# Altium schematic sheet sch.schdoc
size 297 x 209 mm; Symbol: Drawing-Symbol_A4; @Project Name: usbhub; @Page Count: 1; @Update Date: 2026-06-14; @Create Date: 2026-06-14; @Schematic Name: Schematic1; @Page No: 1; @Page Name: P1; Company: EasyEDA.com; Version: V1.0; Page Size: A4; Device: Drawing-Symbol_A4; @Create Time: 20:09:06; @Update Time: 20:09:06; Border: 1; Width: 1170; Height: 825; Region Start: 1; X Region Count: 6; Y Region Count: 4; Blade Width: 10; Title Block Position: 3; @Board Name: Board1
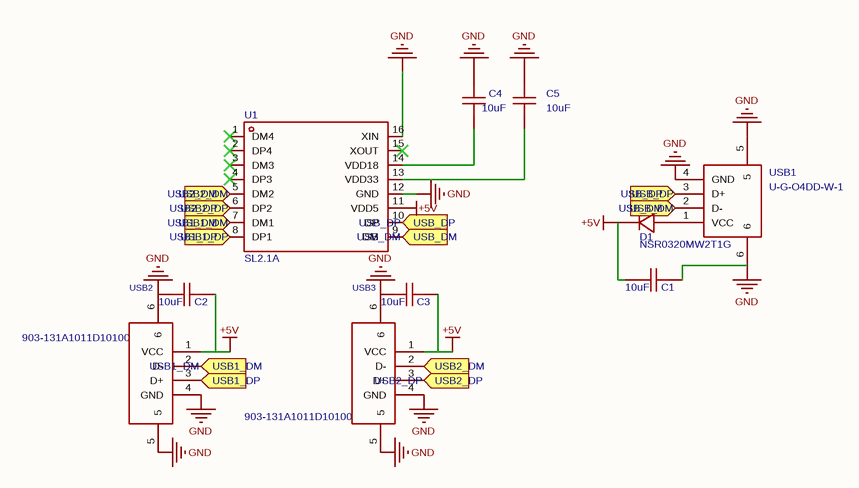
[diagram p0: sch.schdoc]

## Parts
C1  10uF  [C0603]
C2  10uF  [C0603]
C3  10uF  [C0603]
C4  10uF  [C0603]
C5  10uF  [C0603]
D1  NSR0320MW2T1G  [SOD-323_L1.8-W1.3-LS2.5-RD]
U1  SL2.1A  [SOP-16_L10.0-W3.9-P1.27-LS6.0-BL]
USB1  U-G-O4DD-W-1  [USB-A-TH_U-G-04WD-W-01]
USB2  903-131A1011D10100  [USB-A-TH_C46407]
USB3  903-131A1011D10100  [USB-A-TH_C46407]

## Ports
USB1_DM (in), USB1_DP (in), USB2_DM (in), USB2_DP (in), USB_DM (in), USB_DP (in)

## Nets
+5V: C1.1 C2.2 C3.2 D1.1(C) U1.11(VDD5) USB2.1(VCC) USB3.1(VCC)
GND: C1.2 C2.1 C3.1 C4.2 C5.2 U1.12(GND) U1.16(XIN) USB1.4(GND) USB1.5 USB1.6 USB2.4(GND) USB2.5 USB2.6 USB3.4(GND) USB3.5 USB3.6
USB1_DM: U1.7(DM1) USB2.2(D-) ; port USB1_DM
USB1_DP: U1.8(DP1) USB2.3(D+) ; port USB1_DP
USB2_DM: U1.5(DM2) USB3.2(D-) ; port USB2_DM
USB2_DP: U1.6(DP2) USB3.3(D+) ; port USB2_DP
USB_DM: U1.9(DM) USB1.2(D-) ; port USB_DM
USB_DP: U1.10(DP) USB1.3(D+) ; port USB_DP
NetC4_1: C4.1 U1.14(VDD18)
NetC5_1: C5.1 U1.13(VDD33)
NetD1_2: D1.2(A) USB1.1(VCC)

Not connected (* = marked no-connect by the designer): U1 1(DM4)* 2(DP4)* 3(DM3)* 4(DP3)* 15(XOUT)*

## Notes on the sheet
- Create at
- 2026-06-14
- Schematic
- Board
- Schematic1
- Board1
- Update at
- Page
- P1
- Drawn
- Reviewed
- usbhub
- Version
- V1.0
- Size
- A4
- Page  1  Total  1
- EasyEDA.com

## Library data of the parts
C1-C5 = CL10A106KP8NNNC: Capacitance:10uF Tolerance:±10% Tolerance:±10% Voltage Rating:10V Temperature Coefficient:X5R; Manufacturer: SAMSUNG(三星); AddInBom: yes; ModelId: 624118aa3cc7497086c383c2d72e08520819f05c4eef4c71ace90d822a990e87; ModelName: C0603_L1.6-W0.8-H0.8; ModelTransform: 62.992,31.496,0,0,0,0,0,0,0; Tolerance: ±10%; Voltage Rating: 10V; Temperature Coefficient: X5R; Symbol: CL10A106KP8NNNC; Device: CL10A106KP8NNNC; LCSC Part Name: 10uF ±10% 10V; SupplierPart: C19702; ManufacturerPart: CL10A106KP8NNNC; Supplier Footprint: 0603; JLCPCB Part Class: Basic Part; Datasheet: https://item.szlcsc.com/datasheet/CL10A106KP8NNNC/20411.html; Supplier: LCSC; ConvertToPcb: yes; FootprintName: C0603; Value: 10uF
D1 = NSR0320MW2T1G: Voltage - Forward(Vf@If):500mV@900mA Voltage - DC Reverse(Vr):20V Current - Rectified:1A Reverse Leakage Current (Ir):50uA@15V Operating Junction Temperature Range:-55℃~+125℃ Operating Junction Temperature Range:-55℃~+125℃ Non-Repetitive Peak Forward Surg; Manufacturer: onsemi(安森美); AddInBom: yes; ModelId: 533ebfb2f206414f9035ed0ccba1097d0819f05c4eef4c71ace90d822a990e87; ModelTransform: 104.3305,51.181,0,0,0,0,0,-0.004,0; Voltage - DC Reverse(Vr): 20V; Current - Rectified: 1A; Non-Repetitive Peak Forward Surge Current: 5A; Symbol: NSR0320MW2T1G; Device: NSR0320MW2T1G; LCSC Part Name: 电压:20V 电流:1A; SupplierPart: C48192; ManufacturerPart: NSR0320MW2T1G; Supplier Footprint: SOD-323; JLCPCB Part Class: Extended Part; Datasheet: https://item.szlcsc.com/datasheet/NSR0320MW2T1G/49199.html; Supplier: LCSC; ConvertToPcb: yes; FootprintName: SOD-323_L1.8-W1.3-LS2.5-RD; ModelName: SOD-323_L1.8-W1.3-LS2.5-RD; Voltage - Forward(Vf@If): 500mV@900mA; Reverse Leakage Current (Ir): 50uA@15V; Operating Junction Temperature Range: -55℃~+125℃
U1 = SL2.1A: type:Hub USB Protocol:USB 2.0 Voltage - Supply:4V~5.25V Voltage - Supply:4V~5.25V Operating Temperature:0℃~+70℃ Operating Temperature:0℃~+70℃ Current - Supply:120mA Supply Current (Iq):2.5mA Number of Channels:4; Manufacturer: CoreChips(和芯润德); AddInBom: yes; ModelId: 6bb57bd352844810b0c0d78800500b790819f05c4eef4c71ace90d822a990e87; ModelName: SOP-16_L9.9-W3.9-H1.5-LS6.0-P1.27; ModelTransform: 240.39054,393.7,0,90,0,0,0,0,0; USB Protocol: USB 2.0; Current - Supply: 120mA; Supply Current (Iq): 2.5mA; Number of Channels: 4; Symbol: SL2.1A; Device: SL2.1A; LCSC Part Name: USB2.0高速4端口HUB控制器; SupplierPart: C192893; ManufacturerPart: SL2.1A; Supplier Footprint: SOP-16; JLCPCB Part Class: Extended Part; Datasheet: https://item.szlcsc.com/datasheet/SL2.1A/225853.html; Supplier: LCSC; ConvertToPcb: yes; FootprintName: SOP-16_L10.0-W3.9-P1.27-LS6.0-BL; type: Hub; Voltage - Supply: 4V~5.25V; Operating Temperature: 0℃~+70℃
USB1 = U-G-O4DD-W-1: Connector Type:Type-A Protocol Standard:USB 2.0 Gender:Male Mounting Type:Laminated board Number of Contacts:4P Number of Ports:1 Current Rating-Power:1A Voltage Rating:30V Length:18.75mm Detection color:Black; Manufacturer: 韩国韩荣; Symbol: U-G-04DD-W-01; AddInBom: yes; ModelId: f117fd4fae0645b6928a5799178296a70819f05c4eef4c71ace90d822a990e87; ModelName: USB-A-TH_4P-L12.0-W18.8-H4.5-S1.8; ModelTransform: 499.10806,777.879,0,0,0,0,0,-349.685,-102.362; Connector Type: Type-A; Protocol Standard: USB 2.0; Gender: Male; Number of Contacts: 4P; Number of Ports: 1; Current Rating-Power: 1A; Voltage Rating: 30V; Detection color: Black; Device: U-G-O4DD-W-1; LCSC Part Name: Type-A 公 沉板; SupplierPart: C98125; ManufacturerPart: U-G-O4DD-W-1; Supplier Footprint: 插件; JLCPCB Part Class: Extended Part; Datasheet: https://item.szlcsc.com/datasheet/U-G-O4DD-W-1/99334.html; Supplier: LCSC; ConvertToPcb: yes; FootprintName: USB-A-TH_U-G-04WD-W-01; Mounting Type: Laminated board; Length: 18.75mm
USB2 USB3 = 903-131A1011D10100: Connector Type:Type-A Protocol Standard:USB 2.0 Gender:Female Mounting Type:Right Angle Number of Contacts:4P Number of Ports:1 Current Rating-Power:1.5A Voltage Rating:30V Length:13.6mm Detection color:White Operating Temperature:-35℃~+85℃ Operating Temp; Manufacturer: 精拓金; Symbol: USB-AF-90-14.4X13.6-H7.0-DIP; AddInBom: yes; ModelId: 79899d0fc9384fb7acd8a772ab7630450819f05c4eef4c71ace90d822a990e87; ModelName: USB-A-TH_4P-L14.4-W13.6-H7.0-S2.71; ModelTransform: 612.18618,535.432,0,0,0,0,0,-196.85,-137.795; Connector Type: Type-A; Protocol Standard: USB 2.0; Gender: Female; Number of Contacts: 4P; Number of Ports: 1; Current Rating-Power: 1.5A; Voltage Rating: 30V; Detection color: White; Device: 903-131A1011D10100; Supplier: LCSC; Supplier Part: C46407; Manufacturer Part: 903-131A1011D10100; JLCPCB Part Class: Extended Part; LCSC Part Name: Type-A 母 弯插; Supplier Footprint: 插件; Datasheet: https://item.szlcsc.com/datasheet/903-131A1011D10100/47411.html; ConvertToPcb: yes; FootprintName: USB-A-TH_C46407; Mounting Type: Right Angle; Length: 13.6mm; Operating Temperature: -35℃~+85℃